# EAGLE design baseI2C_milling (EAGLE 7.7.0)
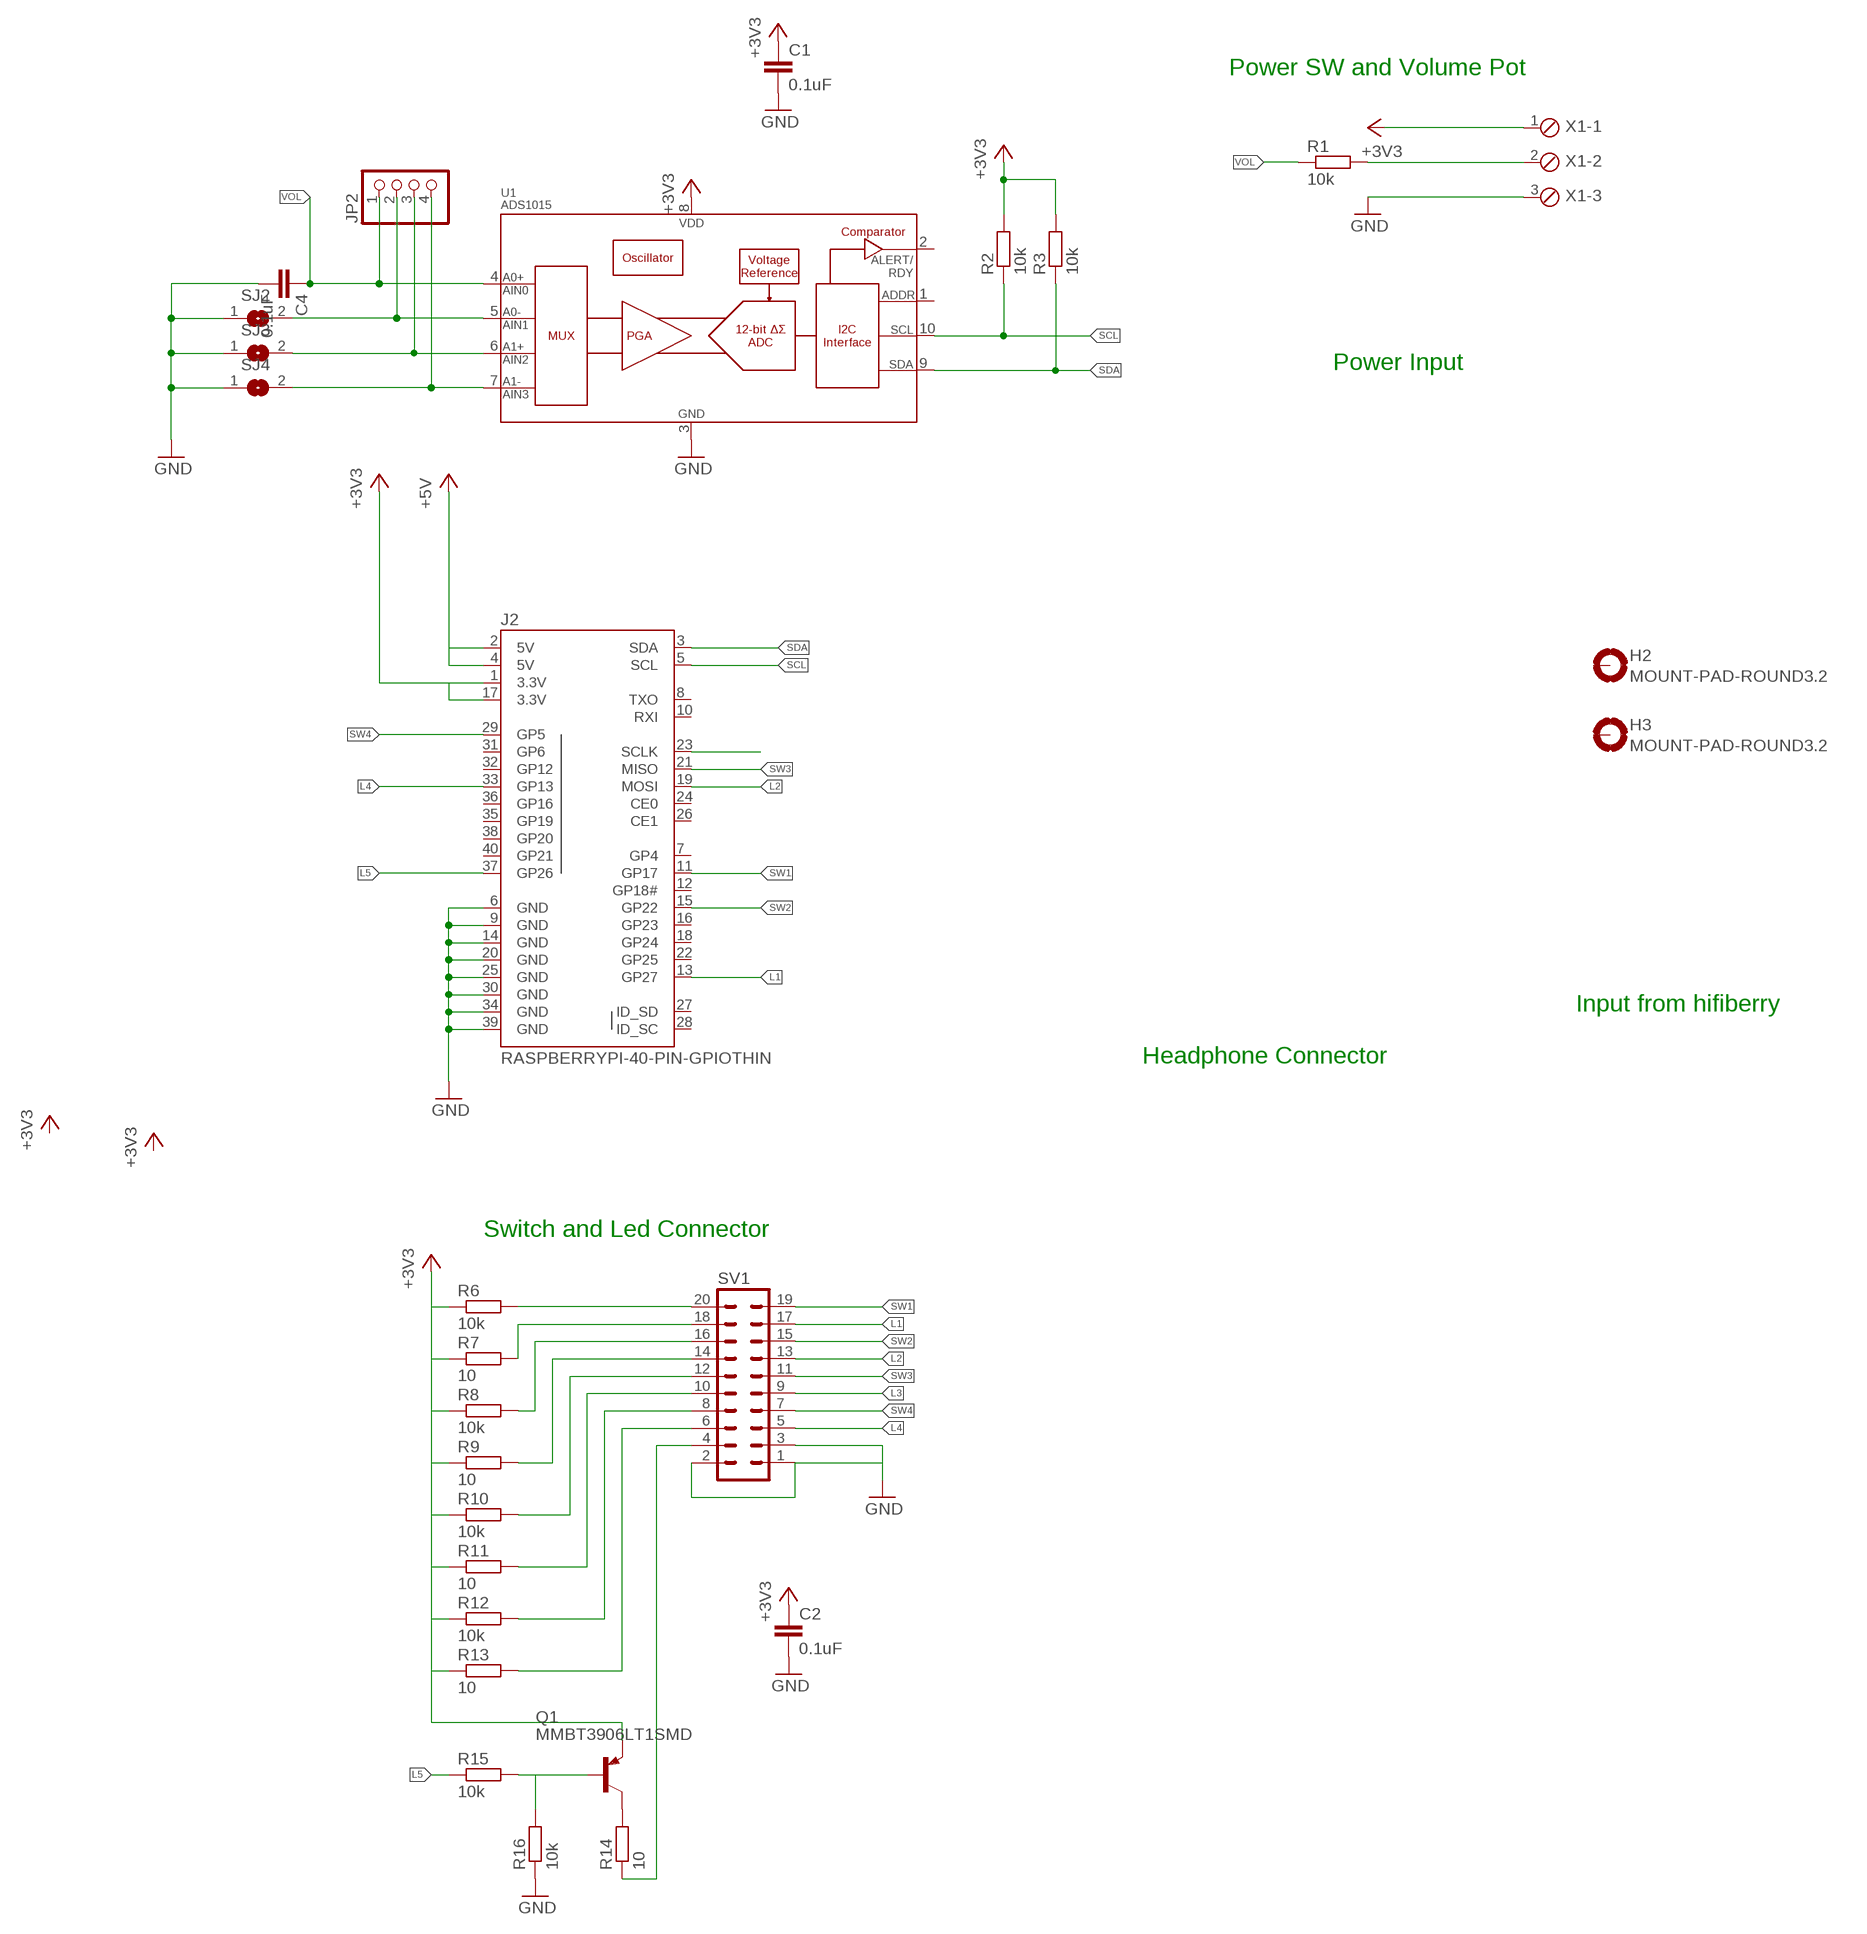
[diagram p0: schematic, sheet 1]

## Parts
C1  0.1uF  C-EUC0805  [C0805]
C2  0.1uF  C-EUC0805  [C0805]
C4  0.1uF  C-EUC0805  [C0805]
H2  MOUNT-PAD-ROUND3.2  [3,2-PAD]
H3  MOUNT-PAD-ROUND3.2  [3,2-PAD]
J2  RASPBERRYPI-40-PIN-GPIOTHIN  [2X20-SHROUDED-THIN]
JP2  PINHD-1X4  [1X04]
Q1  MMBT3906LT1SMD  [SOT23-BEC]
R1  10k  R-EU_R0805  [R0805]
R2  10k  R-EU_R0805  [R0805]
R3  10k  R-EU_R0805  [R0805]
R6  10k  R-EU_R0805  [R0805]
R7  10  R-EU_R0805  [R0805]
R8  10k  R-EU_R0805  [R0805]
R9  10  R-EU_R0805  [R0805]
R10  10k  R-EU_R0805  [R0805]
R11  10  R-EU_R0805  [R0805]
R12  10k  R-EU_R0805  [R0805]
R13  10  R-EU_R0805  [R0805]
R14  10  R-EU_R0805  [R0805]
R15  10k  R-EU_R0805  [R0805]
R16  10k  R-EU_R0805  [R0805]
SJ2  SOLDERJUMPER  [SOLDERJUMPER_ARROW_NOPASTE]
SJ3  SOLDERJUMPER  [SOLDERJUMPER_ARROW_NOPASTE]
SJ4  SOLDERJUMPER  [SOLDERJUMPER_ARROW_NOPASTE]
SV1  ML20  [ML20]
U1  ADS1015  [MSOP10]
X1  MPT3  [3POL254]

## Nets
+3V3: C1.1 C2.1 J2.1(3.3V) J2.17(3.3V) Q1.E R2.2 R3.2 R6.1 R7.1 R8.1 R9.1 R10.1 R11.1 R12.1 R13.1 U1.8(VDD) X1.1
+5V: J2.2(5V) J2.4(5V)
GND: C1.2 C2.2 C4.2 J2.6(GND) J2.9(GND) J2.14(GND) J2.20(GND) J2.25(GND) J2.30(GND) J2.34(GND) J2.39(GND) R16.1 SJ2.1 SJ3.1 SJ4.1 SV1.1 SV1.2 SV1.3 U1.3(VSS) X1.3
L1: J2.13(GP27) SV1.17
L2: J2.19(MOSI) SV1.13
L3: J2.23(SCLK) SV1.9
L4: J2.33(GP13) SV1.5
L5: J2.37(GP26) R15.1
N$1: Q1.C R14.2
N$2: Q1.B R15.2 R16.2
N$3: R8.2 SV1.16
N$4: R9.2 SV1.14
N$5: R6.2 SV1.20
N$6: R7.2 SV1.18
N$7: R10.2 SV1.12
N$8: JP2.2 SJ2.2 U1.5(AIN1)
N$9: R1.2 X1.2
N$10: R11.2 SV1.10
N$11: JP2.3 SJ3.2 U1.6(AIN2)
N$12: JP2.4 SJ4.2 U1.7(AIN3)
N$13: R12.2 SV1.8
N$14: R13.2 SV1.6
N$15: R14.1 SV1.4
SCL: J2.5(SCL) R2.1 U1.10(SCL)
SDA: J2.3(SDA) R3.1 U1.9(SDA)
SW1: J2.11(GP17) SV1.19
SW2: J2.15(GP22) SV1.15
SW3: J2.21(MISO) SV1.11
SW4: J2.29(GP5) SV1.7
VOL: C4.1 JP2.1 R1.1 U1.4(AIN0)
Unconnected: H2.B3,2(MOUNT) H3.B3,2(MOUNT) J2.7(GP4) J2.8(TXO) J2.10(RXI) J2.12(GP18#) J2.16(GP23) J2.18(GP24) J2.22(GP25) J2.24(CE0) J2.26(CE1) J2.27(ID_SD) J2.28(ID_SC) J2.31(GP6) J2.32(GP12) J2.35(GP19) J2.36(GP16) J2.38(GP20) J2.40(GP21) U1.1(ADDR) U1.2(ALERT/RDY)

## Notes on the sheet
- Power SW and Volume Pot
- Power Input
- Input from hifiberry
- Headphone Connector
- Switch and Led Connector

## Library data of the parts
C1 C2 C4 = rcl:C-EU: CAPACITOR, European symbol
H2 H3 = holes:MOUNT-PAD-ROUND: MOUNTING PAD, round
J2 = SparkFun-Boards:RASPBERRYPI-40-PIN-GPIO: Second Generation Raspberry Pi GPIO Header 2x20 pin connector, as found on B, B+, A+ models.
JP2 = pinhead:PINHD-1X4: PIN HEADER
Q1 = transistor-pnp:MMBT3906*: PNP Transistror
R1-R3 R6-R16 = resistor:R-EU_: RESISTOR, European symbol
SJ2-SJ4 = microbuilder:SOLDERJUMPER: SMD Solder JUMPER Solder the two pads together to create a connection, or remove the solder to break it. REFLOW - Use this footprint for solder paste and reflow ovens. WAVE - Use this footprint for hand-soldering (larger pads). CLOSED - Has a trace between the two pads to ensure it is closed by default. The trace needs to be cut to disable the jumper, and can be closed again by creating a solder bridge between the two pads.; BOM: EXCLUDE
SV1 = con-ml:ML20: HARTING; OC_FARNELL: unknown; OC_NEWARK: unknown
U1 = SparkFun-AnalogIC:ADS1015: 12-Bit Del-Sig ADC Four single-ended inputs or two differential inputs Internal PGA I2C interface 2.0-5.5V; PROD_ID: IC-12239
X1 = con-phoenix-254:MPT3: PHOENIX CONNECTOR; OC_FARNELL: unknown; OC_NEWARK: unknown

## Board
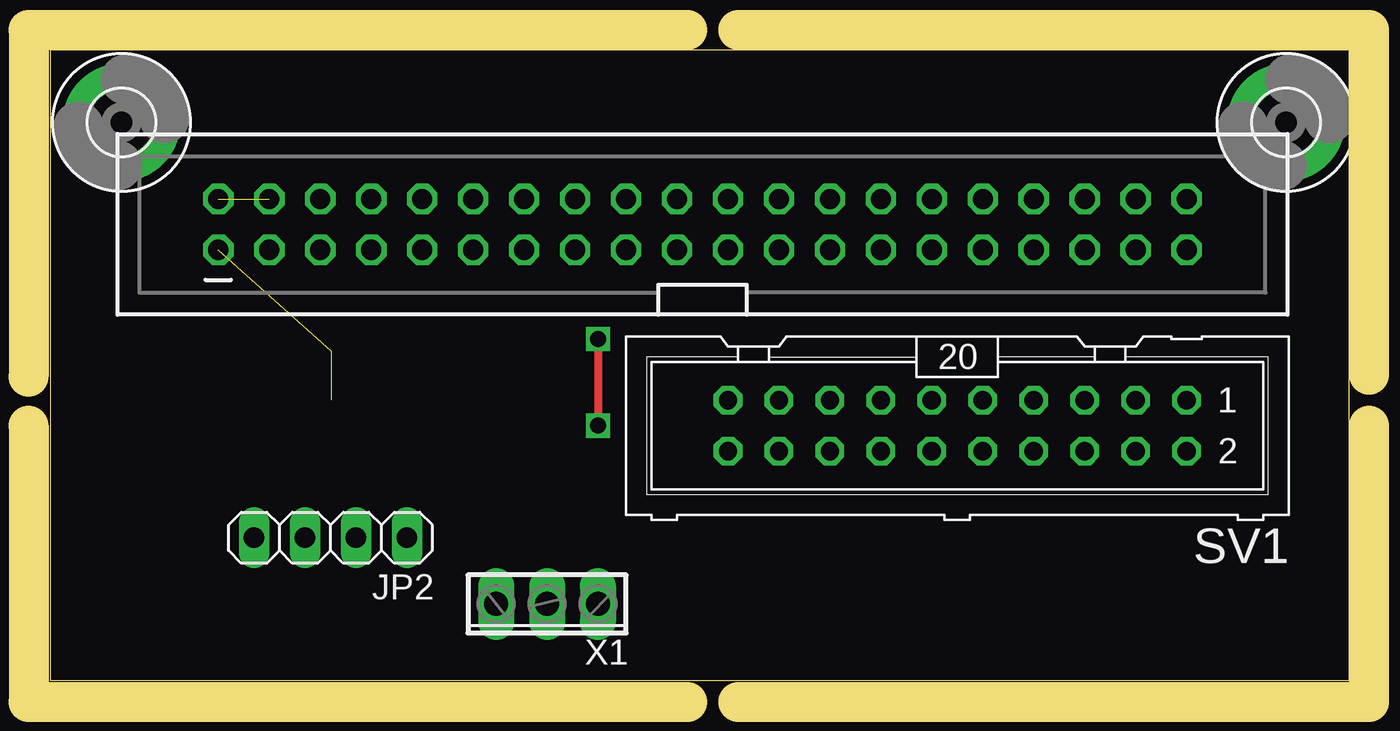
[diagram p1: board, top side]
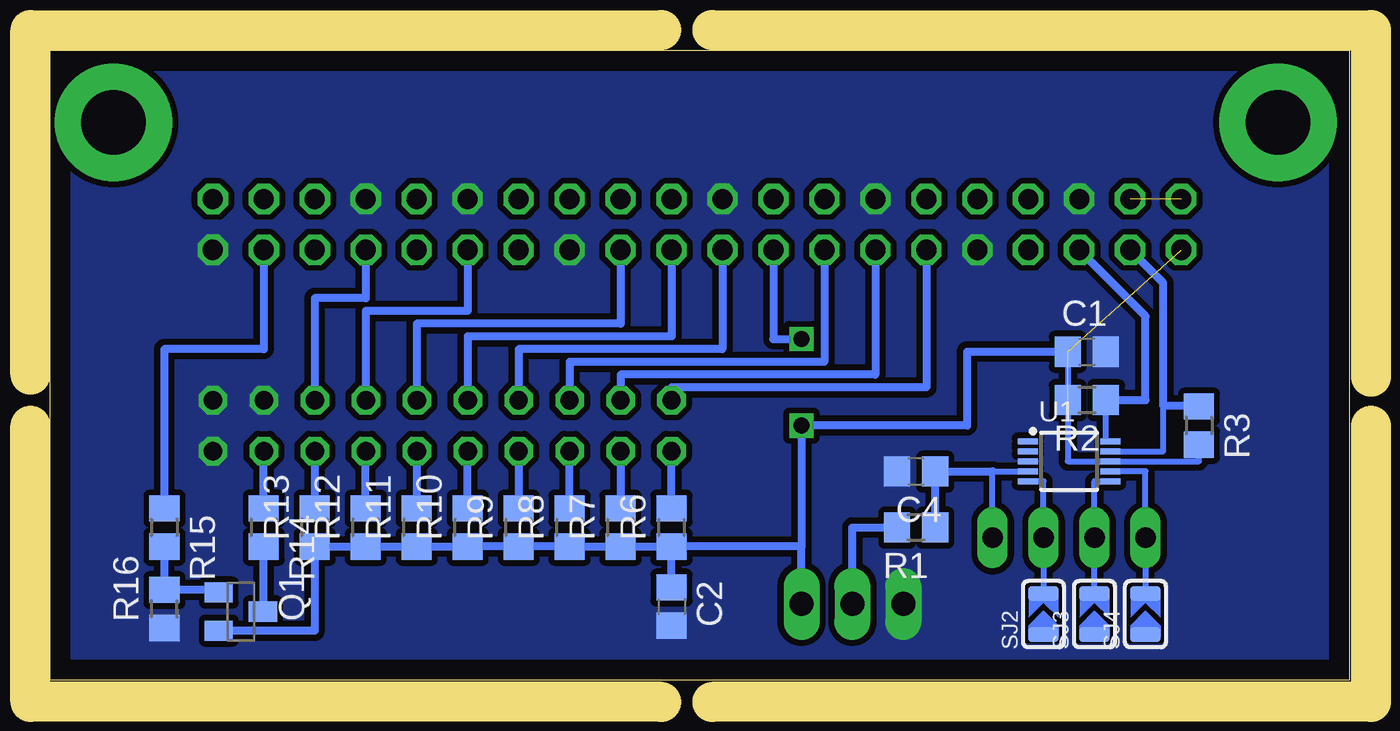
[diagram p2: board, bottom side, seen from below]

Size 64.75 x 31.42 mm. Coordinates in mm from the lower left corner, seen from the top.
Outline: 0,0 64.75,0 64.75,31.42 0,31.42 0,0
Copper layers (1*16): Top 0.035mm / dielectric 1.5mm / Bottom 0.035mm
Design rules "default": minimum track width 10mil, minimum drill 24mil, track to track 8mil, track to pad 8mil, pad to pad 8mil, via to via 8mil, smd to smd 8mil, copper to edge 40mil, drill to drill 8mil, minimum pad ring 10mil, minimum via ring 8mil, stop-mask expansion 4mil, vias tented up to drill 0mil, thermal gap 10mil
Milling: 8 lines

### Footprints (pad centres in the part's own frame; a part is rotated, then mirrored left to right if it is on the bottom)
C0805 = smd 1.3 x 1.5: 1 -0.95,0; 2 0.95,0
3,2-PAD = drill 3.2 pad 5.842: B3,2 0,0
2X20-SHROUDED-THIN = drill 1 octagon: 1 -1.27,24.13; 2 1.27,24.13; 3 -1.27,21.59; 4 1.27,21.59; 5 -1.27,19.05; 6 1.27,19.05; 7 -1.27,16.51; 8 1.27,16.51; 9 -1.27,13.97; 10 1.27,13.97; 11 -1.27,11.43; 12 1.27,11.43; 13 -1.27,8.89; 14 1.27,8.89; 15 -1.27,6.35; 16 1.27,6.35; 17 -1.27,3.81; 18 1.27,3.81; 19 -1.27,1.27; 20 1.27,1.27; 21 -1.27,-1.27; 22 1.27,-1.27; 23 -1.27,-3.81; 24 1.27,-3.81; 25 -1.27,-6.35; 26 1.27,-6.35; 27 -1.27,-8.89; 28 1.27,-8.89; 29 -1.27,-11.43; 30 1.27,-11.43; 31 -1.27,-13.97; 32 1.27,-13.97; 33 -1.27,-16.51; 34 1.27,-16.51; 35 -1.27,-19.05; 36 1.27,-19.05; 37 -1.27,-21.59; 38 1.27,-21.59; 39 -1.27,-24.13; 40 1.27,-24.13
1X04 = drill 1.016 long: 1 -3.81,0; 2 -1.27,0; 3 1.27,0; 4 3.81,0
SOT23-BEC = smd 1 x 1.4: B -0.95,-1.1; C 0,1.1; E 0.95,-1.1
R0805 = smd 1.3 x 1.5: 1 -0.95,0; 2 0.95,0
SOLDERJUMPER_ARROW_NOPASTE = smd 0.762 x 1.524: 1 -1.016,0; 2 1.016,0
ML20 = drill 0.914 octagon: 1 -11.43,-1.27; 2 -11.43,1.27; 3 -8.89,-1.27; 4 -8.89,1.27; 5 -6.35,-1.27; 6 -6.35,1.27; 7 -3.81,-1.27; 8 -3.81,1.27; 9 -1.27,-1.27; 10 -1.27,1.27; 11 1.27,-1.27; 12 1.27,1.27; 13 3.81,-1.27; 14 3.81,1.27; 15 6.35,-1.27; 16 6.35,1.27; 17 8.89,-1.27; 18 8.89,1.27; 19 11.43,-1.27; 20 11.43,1.27
MSOP10 = smd 0.3 x 1: 1 -1,-2.05; 2 -0.5,-2.05; 3 0,-2.05; 4 0.5,-2.05; 5 1,-2.05; 6 1,2.05; 7 0.5,2.05; 8 0,2.05; 9 -0.5,2.05; 10 -1,2.05
3POL254 = drill 1.2 long: 1 -2.54,0; 2 0,0; 3 2.54,0

### Placement (x,y rotation side)
C1  13.08,16.38 0 bottom
C2  33.78,3.68 270 bottom
C4  21.59,10.41 180 bottom
H2  3.56,27.81 0 top
H3  61.59,27.81 0 top
J2  32.51,22.73 90 top
JP2  13.97,7.11 180 top
Q1  55.24,3.43 270 bottom
R1  21.59,7.62 180 bottom
R2  13.08,13.97 180 bottom
R3  7.49,12.7 270 bottom
R6  33.78,7.62 90 bottom
R7  36.32,7.62 90 bottom
R8  38.86,7.62 90 bottom
R9  41.4,7.62 90 bottom
R10  43.94,7.62 90 bottom
R11  46.48,7.62 90 bottom
R12  49.02,7.62 90 bottom
R13  51.56,7.62 90 bottom
R14  54.1,7.62 270 bottom
R15  59.05,7.62 270 bottom
R16  59.05,3.56 90 bottom
SJ2  15.24,3.3 90 bottom
SJ3  12.7,3.3 90 bottom
SJ4  10.16,3.3 90 bottom
SV1  45.21,12.7 180 top
U1  13.97,10.92 270 bottom
X1  24.77,3.81 180 top

### Tracks (layer width: path | path; a pad name or v marks a point on that pad's centre or on a via)
+3V3  (via drill 0.8)  (2 unrouted)
  Top 0.406: v27.3,17.02 v27.3,12.7
  Bottom 0.305: C1.1 14.04,10.92 U1.8 7.49,10.92 R3.2
  Bottom 0.406: R6.1 R7.1 R8.1 R9.1 R10.1 R11.1 R12.1 R13.1 51.56,2.48 Q1.E | R6.1 | C2.1 R6.1 | J2.17 28.7,17.02 v27.3,17.02 | 27.3,6.67 v27.3,12.7 19.05,12.7 19.05,16.38 C1.1 | 27.3,6.67 R6.1 | X1.1 27.3,6.67
+5V  (1 unrouted)
GND
  pour Bottom (isolate 0.305, no thermals): -8.89,-10.16 77.47,-10.16 77.47,40.64 -8.89,40.64
L1
  Bottom 0.406: J2.13 23.62,15.24 36.32,15.24 SV1.17
L2
  Bottom 0.406: J2.19 31.24,16.51 41.4,16.51 SV1.13
L3
  Bottom 0.406: J2.23 36.32,17.78 46.48,17.78 SV1.9
L4
  Bottom 0.406: J2.33 49.02,19.05 51.56,19.05 SV1.5
L5
  Bottom 0.406: R15.1 59.05,16.51 54.1,16.51 J2.37
N$1
  Bottom 0.406: Q1.C 54.1,3.47 R14.2
N$2
  Bottom 0.406: R15.2 R16.2 56.47,4.51 Q1.B
N$3
  Bottom 0.406: R8.2 SV1.16
N$4
  Bottom 0.406: SV1.14 R9.2
N$5
  Bottom 0.406: R6.2 SV1.20
N$6
  Bottom 0.406: SV1.18 R7.2
N$7
  Bottom 0.406: R10.2 SV1.12
N$8
  Bottom 0.305: SJ2.2 JP2.2 15.24,9.92 U1.5
N$9
  Bottom 0.406: X1.2 24.77,7.62 R1.2
N$10
  Bottom 0.406: SV1.10 R11.2
N$11
  Bottom 0.305: SJ3.2 JP2.3 12.7,9.92 U1.6
N$12
  Bottom 0.305: U1.7 10.16,10.42 JP2.4 SJ4.2
N$13
  Bottom 0.406: R12.2 SV1.8
N$14
  Bottom 0.406: SV1.6 R13.2
N$15
  Bottom 0.406: R14.1 SV1.4
SCL
  Bottom 0.305: U1.10 12.13,11.92 R2.1
  Bottom 0.406: R2.1 10.16,13.97 10.16,18.16 J2.5
SDA
  Bottom 0.305: U1.9 9.27,11.42 9.27,13.72
  Bottom 0.406: J2.3 9.27,19.81 9.27,13.72 7.56,13.72 R3.1
SW1
  Bottom 0.406: J2.11 21.08,14.61 33.78,14.61 SV1.19
SW2
  Bottom 0.406: J2.15 26.16,15.88 38.86,15.88 SV1.15
SW3
  Bottom 0.406: J2.21 33.78,17.14 43.94,17.14 SV1.11
SW4
  Bottom 0.406: J2.29 43.94,18.41 49.02,18.41 SV1.7
VOL
  Bottom 0.305: JP2.1 17.78,10.42 U1.4
  Bottom 0.406: R1.1 C4.1 17.78,10.41 17.78,10.42